# Altium schematic sheet MCU.SchDoc
size A4
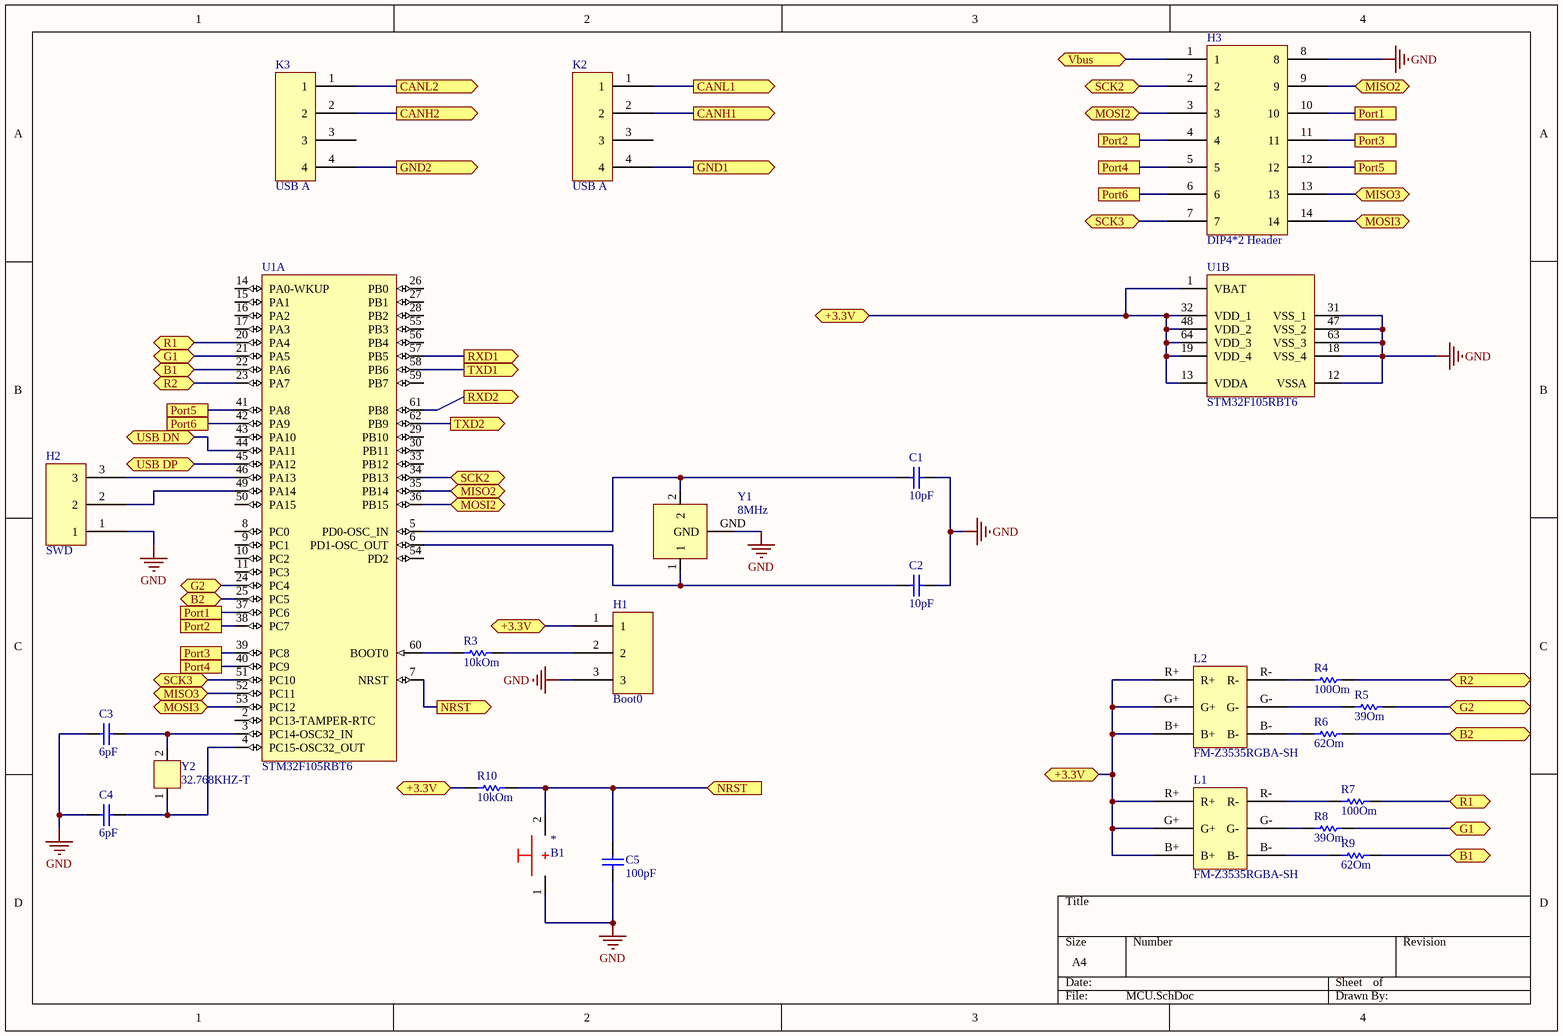
[diagram p0: MCU.SchDoc]

## Parts
*  B1  [Button 3.5x6x4.3mm]
C1  10pF  [CAPC1608X90X35ML10T15]
C2  10pF  [CAPC1608X90X35ML10T15]
C3  6pF  [CAPC1608X90X35ML10T15]
C4  6pF  [CAPC1608X90X35ML10T15]
C5  100pF  [CAPC1608X90X35ML10T15]
H1  Boot0  [DIP3]
H2  SWD  [DIP3]
H3  DIP4*2 Header  [DIP7*2]
K2  USB A  [USB A]
K3  USB A  [USB A]
L1  FM-Z3535RGBA-SH  [Z3535RGBA]
L2  FM-Z3535RGBA-SH  [Z3535RGBA]
R3  10kOm  [RESC1608X55X30ML20T10]
R4  100Om  [RESC1608X55X30ML20T10]
R5  39Om  [RESC1608X55X30ML20T10]
R6  62Om  [RESC1608X55X30ML20T10]
R7  100Om  [RESC1608X55X30ML20T10]
R8  39Om  [RESC1608X55X30ML20T10]
R9  62Om  [RESC1608X55X30ML20T10]
R10  10kOm  [RESC1608X55X30ML20T10]
U1  STM32F105RBT6  [STM-LQFP64_V]  (parts A,B of 2)
Y1  8MHz  [SMD-5032 resonator]
Y2  32.768KHZ-T  [SMD-2012]

## Ports
+3.3V (bidir), B1 (bidir), B2 (bidir), CANH1 (out), CANH2 (out), CANL1 (out), CANL2 (out), G1 (bidir), G2 (bidir), GND1 (out), GND2 (out), MISO2 (bidir), MISO3 (bidir), MOSI2 (bidir), MOSI3 (bidir), NRST (in), NRST (out), Port1, Port2, Port3, Port4, Port5, Port6, R1 (bidir), R2 (bidir), RXD1 (out), RXD2 (out), SCK2 (bidir), SCK3 (bidir), TXD1 (out), TXD2 (out), USB DN (bidir), USB DP (bidir), Vbus (bidir)

## Nets
GND: *.1 C1.2 C2.2 C3.1 C4.1 C5.1 H1.3 H2.1 H3.8 U1.12(VSSA) U1.18(VSS_4) U1.31(VSS_1) U1.47(VSS_2) U1.63(VSS_3) Y1.GND
+3.3V: H1.1 L1.B+ L1.G+ L1.R+ L2.B+ L2.G+ L2.R+ R10.1 U1.1(VBAT) U1.13(VDDA) U1.19(VDD_4) U1.32(VDD_1) U1.48(VDD_2) U1.64(VDD_3) ; port +3.3V
B1: R9.2 U1.22(PA6) ; port B1
B2: R6.2 U1.25(PC5) ; port B2
CANH1: K2.2 ; port CANH1
CANH2: K3.2 ; port CANH2
CANL1: K2.1 ; port CANL1
CANL2: K3.1 ; port CANL2
G1: R8.2 U1.21(PA5) ; port G1
G2: R5.2 U1.24(PC4) ; port G2
GND1: K2.4 ; port GND1
GND2: K3.4 ; port GND2
MISO2: H3.9 U1.35(PB14) ; port MISO2
MISO3: H3.13 U1.52(PC11) ; port MISO3
MOSI2: H3.3 U1.36(PB15) ; port MOSI2
MOSI3: H3.14 U1.53(PC12) ; port MOSI3
NRST: *.2 C5.2 R10.2 U1.7(NRST) ; port NRST
Port1: H3.10 U1.37(PC6) ; port Port1
Port2: H3.4 U1.38(PC7) ; port Port2
Port3: H3.11 U1.39(PC8) ; port Port3
Port4: H3.5 U1.40(PC9) ; port Port4
Port5: H3.12 U1.41(PA8) ; port Port5
Port6: H3.6 U1.42(PA9) ; port Port6
R1: R7.2 U1.20(PA4) ; port R1
R2: R4.2 U1.23(PA7) ; port R2
RXD1: U1.57(PB5) ; port RXD1
RXD2: U1.61(PB8) ; port RXD2
SCK2: H3.2 U1.34(PB13) ; port SCK2
SCK3: H3.7 U1.51(PC10) ; port SCK3
TXD1: U1.58(PB6) ; port TXD1
TXD2: U1.62(PB9) ; port TXD2
USB DN: U1.44(PA11) ; port USB DN
USB DP: U1.45(PA12) ; port USB DP
Vbus: H3.1 ; port Vbus
NetC1_1: C1.1 U1.5(PD0-OSC_IN) Y1.2
NetC2_1: C2.1 U1.6(PD1-OSC_OUT) Y1.1
NetC3_2: C3.2 U1.3(PC14-OSC32_IN) Y2.2
NetC4_2: C4.2 U1.4(PC15-OSC32_OUT) Y2.1
NetH1_2: H1.2 R3.2
NetH2_2: H2.2 U1.49(PA14)
NetH2_3: H2.3 U1.46(PA13)
NetL1_B-: L1.B- R9.1
NetL1_G-: L1.G- R8.1
NetL1_R-: L1.R- R7.1
NetL2_B-: L2.B- R6.1
NetL2_G-: L2.G- R5.1
NetL2_R-: L2.R- R4.1
NetR3_1: R3.1 U1.60(BOOT0)

Not connected (* = marked no-connect by the designer): K2 3; K3 3; U1 2(PC13-TAMPER-RTC) 8(PC0) 9(PC1) 10(PC2) 11(PC3) 14(PA0-WKUP) 15(PA1) 16(PA2) 17(PA3) 26(PB0) 27(PB1) 28(PB2) 29(PB10) 30(PB11) 33(PB12) 43(PA10) 50(PA15) 54(PD2) 55(PB3) 56(PB4) 59(PB7)

## Library data of the parts
* = Button
C1-C5 = CMP-2006-02335-1: Manufacturer: Murata; Part Number: GCM1885C2A101JA16D
H1 H2 = DIP3 header
R3-R10 = CMP-2000-01555-1: Part Number: RK73H1JTTD5101F; Manufacturer: KOA Speer
U1 = CMP-0237-00224-3: ARM Cortex-M3 32-bit MCU, 128 KB Flash, 64 KB Internal RAM, 51 I/Os, 64-pin LQFP, -40 to 85 degC, Tray; D/A Converter: 2x12-bit (2 Channel); Supply Voltage(Vcc) min (V): 2; A/D Converter: 2x12-bit (16 Channel); Internal RAM Size (kB): 64; Operating Frequency(F) (Processor speed) (MHz): 72; FLASH Size (Prog) (kB): 128; I/Os (High Current): 51; ComponentLink2Description: Datasheet; Core: ARM Cortex-M3; ComponentLink2URL: http://www.st.com/st-web-ui/static/active/en/resource/technical/document/datasheet/CD00220364.pdf; Mounting Technology: Surface Mount; PackageVersion: Rev. 4, 06/2013; PackageReference: LQFP64; PartNumber: STM32F105RBT6; ComponentLink3URL: http://www.st.com/st-web-ui/static/active/en/resource/technical/document/datasheet/DM00037051.pdf; DatasheetVersion: Rev. 6; PackageDescription: 64-Pin Low Profile Quad Flat Package, 10 x 10 mm Body, 0.5 mm Pitch; ComponentLink3Description: Package Specification; ComponentLink1Description: Manufacturer URL; ComponentLink1URL: http://www.st.com/web/en/home.html; Packing: Tray
Y1 = TXC Corp 7B08070003 resonator
Y2 = Abracon LLC ABS06-107-32.768KHZ-T: ComponentLink1Description: New link; ComponentLink1URL: https://lcsc.com/product-detail/SMD-Crystal-Resonators_Abracon-LLC_ABS06-107-32-768KHZ-T_Abracon-LLC-ABS06-107-32-768KHZ-T_C276418.html
L1 L2 = FM-Z3535RGBA-SH: ComponentLink1Description: New link; ComponentLink1URL: https://lcsc.com/product-detail/Light-Emitting-Diodes-LED_SMDLED-120-480mcd_C110903.html